# EAGLE design 16bit_Wing_Template (EAGLE 5.06)
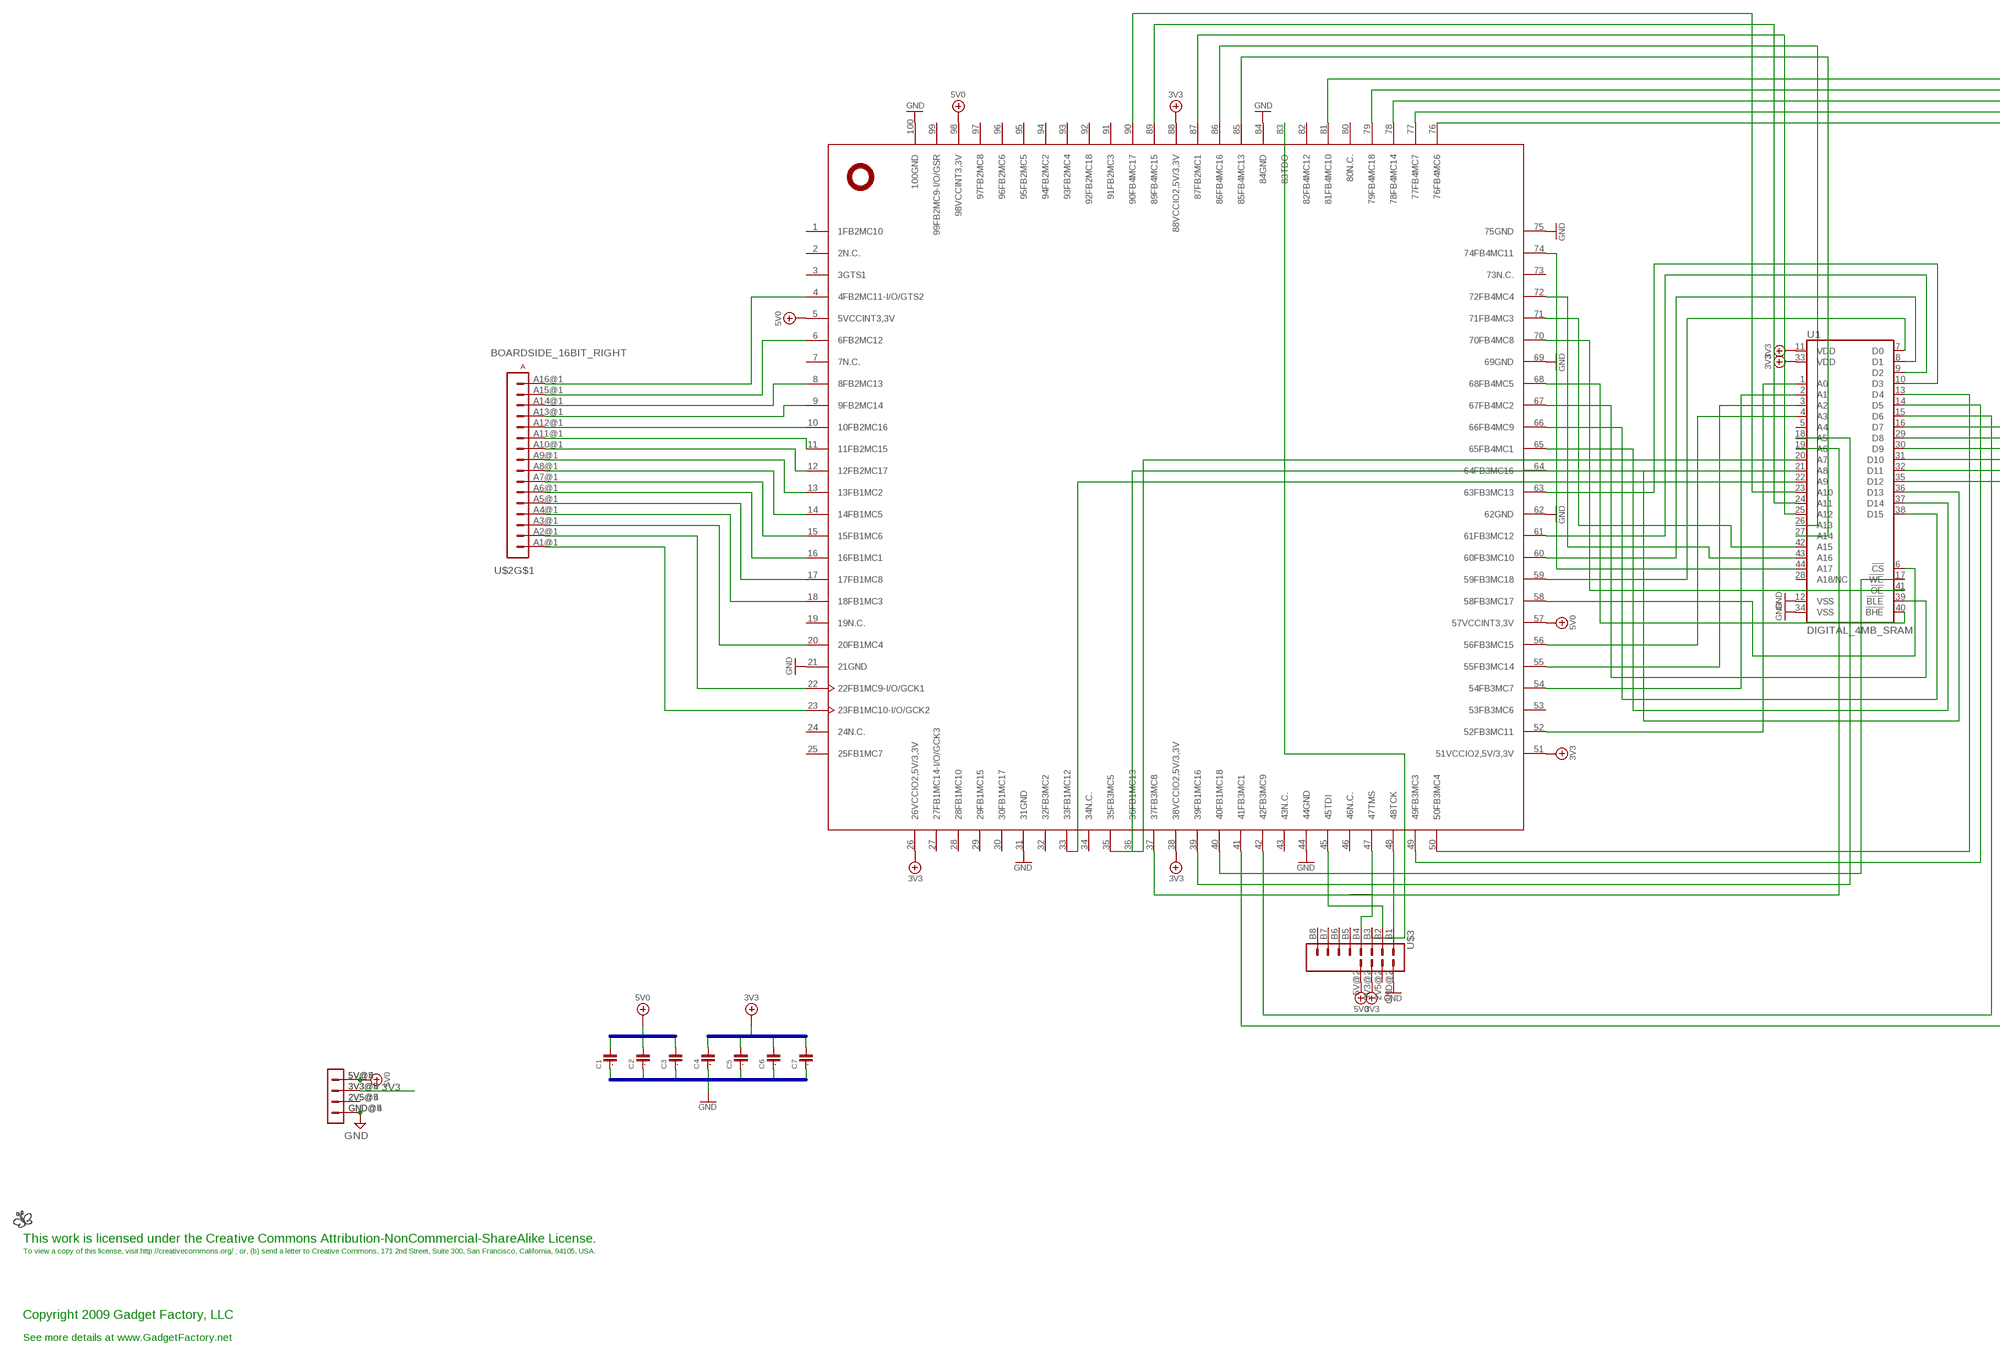
[diagram p0: schematic, sheet 1]

## Parts
C1  C0805  [0805]
C2  C0805  [0805]
C3  C0805  [0805]
C4  C0805  [0805]
C5  C0805  [0805]
C6  C0805  [0805]
C7  C0805  [0805]
LOGO1  BUTTERFLY_LOGO  [BUTTERFLY_LOGO]
U1  DIGITAL_4MB_SRAM  [TSOP44-II]
U$1  XC9572XLTQ100  [TQ100]
U$2  BOARDSIDE_16BIT_RIGHT  [BOARDSIDE_16BIT_RIGHT]
U$3  WING_8BIT  [WINGSIDE_8BIT]

## Nets
3V3: C4.2 C5.2 C6.2 C7.2 U1.11(VDD) U1.33(VDD) U$1.26(26VCCIO2,5V/3,3V) U$1.38(38VCCIO2,5V/3,3V) U$1.51(51VCCIO2,5V/3,3V) U$1.88(88VCCIO2,5V/3,3V) U$2.3V3@4(3V3) U$2.3V3@5(3V3) U$3.3V3@2(3V3)
5V0: C1.2 C2.2 C3.2 U$1.5(5VCCINT3,3V) U$1.57(57VCCINT3,3V) U$1.98(98VCCINT3,3V) U$2.5V@4(5V) U$2.5V@5(5V) U$3.5V@2(5V)
GND: C1.1 C2.1 C3.1 C4.1 C5.1 C6.1 C7.1 U1.12(VSS) U1.34(VSS) U$1.21(21GND) U$1.31(31GND) U$1.44(44GND) U$1.62(62GND) U$1.69(69GND) U$1.75(75GND) U$1.84(84GND) U$1.100(100GND) U$2.GND@4(GND) U$2.GND@5(GND) U$3.GND@2(GND)
N$1: U$1.48(48TCK) U$3.B1
N$2: U$1.4(4FB2MC11-I/O/GTS2) U$2.A16@1(A16)
N$3: U$2.2V5@4(2V5) U$2.2V5@5(2V5)
N$4: U$1.6(6FB2MC12) U$2.A15@1(A15)
N$5: U$1.8(8FB2MC13) U$2.A14@1(A14)
N$6: U$1.9(9FB2MC14) U$2.A13@1(A13)
N$7: U$1.10(10FB2MC16) U$2.A12@1(A12)
N$8: U$1.11(11FB2MC15) U$2.A11@1(A11)
N$9: U$1.12(12FB2MC17) U$2.A10@1(A10)
N$10: U$1.13(13FB1MC2) U$2.A9@1(A9)
N$11: U$1.14(14FB1MC5) U$2.A8@1(A8)
N$12: U$1.15(15FB1MC6) U$2.A7@1(A7)
N$13: U$1.16(16FB1MC1) U$2.A6@1(A6)
N$14: U$1.17(17FB1MC8) U$2.A5@1(A5)
N$15: U$1.18(18FB1MC3) U$2.A4@1(A4)
N$16: U$1.20(20FB1MC4) U$2.A3@1(A3)
N$17: U$1.22(22FB1MC9-I/O/GCK1) U$2.A2@1(A2)
N$18: U$1.23(23FB1MC10-I/O/GCK2) U$2.A1@1(A1)
N$19: U1.1(A0) U$1.52(52FB3MC11)
N$20: U1.2(A1) U$1.54(54FB3MC7)
N$21: U1.3(A2) U$1.55(55FB3MC14)
N$22: U1.4(A3) U$1.56(56FB3MC15)
N$23: U1.6(!CS) U$1.58(58FB3MC17)
N$24: U1.7(D0) U$1.59(59FB3MC18)
N$25: U1.8(D1) U$1.60(60FB3MC10)
N$26: U1.9(D2) U$1.61(61FB3MC12)
N$27: U1.10(D3) U$1.63(63FB3MC13)
N$28: U1.41(!OE) U$1.70(70FB4MC8)
N$29: U1.44(A17) U$1.74(74FB4MC11)
N$30: U1.43(A16) U$1.72(72FB4MC4)
N$31: U1.42(A15) U$1.71(71FB4MC3)
N$32: U1.40(!BHE) U$1.68(68FB4MC5)
N$33: U1.39(!BLE) U$1.67(67FB4MC2)
N$34: U1.38(D15) U$1.66(66FB4MC9)
N$35: U1.37(D14) U$1.65(65FB4MC1)
N$36: U1.36(D13) U$1.64(64FB3MC16)
N$37: U$1.45(45TDI) U$3.B2
N$39: U$1.47(47TMS) U$3.B4
N$40: U$1.83(83TDO) U$3.B3
N$41: U1.13(D4) U$1.50(50FB3MC4)
N$42: U1.14(D5) U$1.49(49FB3MC3)
N$43: U1.15(D6) U$1.42(42FB3MC9)
N$44: U1.16(D7) U$1.41(41FB3MC1)
N$45: U1.17(!WE) U$1.40(40FB1MC18)
N$46: U1.18(A5) U$1.39(39FB1MC16)
N$47: U1.19(A6) U$1.37(37FB3MC8)
N$48: U1.20(A7) U$1.36(36FB1MC13)
N$49: U1.21(A8) U$1.35(35FB3MC5)
N$50: U1.22(A9) U$1.33(33FB1MC12)
N$51: U1.35(D12) U$1.76(76FB4MC6)
N$52: U1.32(D11) U$1.77(77FB4MC7)
N$53: U1.31(D10) U$1.78(78FB4MC14)
N$54: U1.30(D9) U$1.79(79FB4MC18)
N$55: U1.29(D8) U$1.81(81FB4MC10)
N$56: U1.27(A14) U$1.85(85FB4MC13)
N$57: U1.26(A13) U$1.86(86FB4MC16)
N$58: U1.25(A12) U$1.87(87FB2MC1)
N$59: U1.24(A11) U$1.89(89FB4MC15)
N$60: U1.23(A10) U$1.90(90FB4MC17)
Unconnected: U1.5(A4) U1.28(A18/NC) U$1.1(1FB2MC10) U$1.2(2N.C.) U$1.3(3GTS1) U$1.7(7N.C.) U$1.19(19N.C.) U$1.24(24N.C.) U$1.25(25FB1MC7) U$1.27(27FB1MC14-I/O/GCK3) U$1.28(28FB1MC10) U$1.29(29FB1MC15) U$1.30(30FB1MC17) U$1.32(32FB3MC2) U$1.34(34N.C.) U$1.43(43N.C.) U$1.46(46N.C.) U$1.53(53FB3MC6) U$1.73(73N.C.) U$1.80(80N.C.) U$1.82(82FB4MC12) U$1.91(91FB2MC3) U$1.92(92FB2MC18) U$1.93(93FB2MC4) U$1.94(94FB2MC2) U$1.95(95FB2MC5) U$1.96(96FB2MC6) U$1.97(97FB2MC8) U$1.99(99FB2MC9-I/O/GSR) U$3.2V5@2(2V5) U$3.B5 U$3.B6 U$3.B7 U$3.B8

## Buses
GND
5V0
3V3

## Notes on the sheet
- This work is licensed under the Creative Commons Attribution-NonCommercial-ShareAlike License.
- To view a copy of this license, visit http://creativecommons.org/ ; or, (b) send a letter to Creative Commons, 171 2nd Street, Suite 300, San Francisco, California, 94105, USA.
- Copyright 2009 Gadget Factory, LLC
- See more details at www.GadgetFactory.net

## Library data of the parts
C1-C7 = GadgetFactory:C: CAPACITOR, European symbol
LOGO1 = GadgetFactory_Pub:BUTTERFLY_LOGO
U1 = Bogdan_Commons:DIGITAL_4MB_SRAM
U$1 = xilinx_xc9572xl-tq100:XC9572XLTQ100
U$2 = GadgetFactory_Pub:BOARDSIDE_16BIT_RIGHT
U$3 = GadgetFactory_Pub:WING_8BIT

## Board
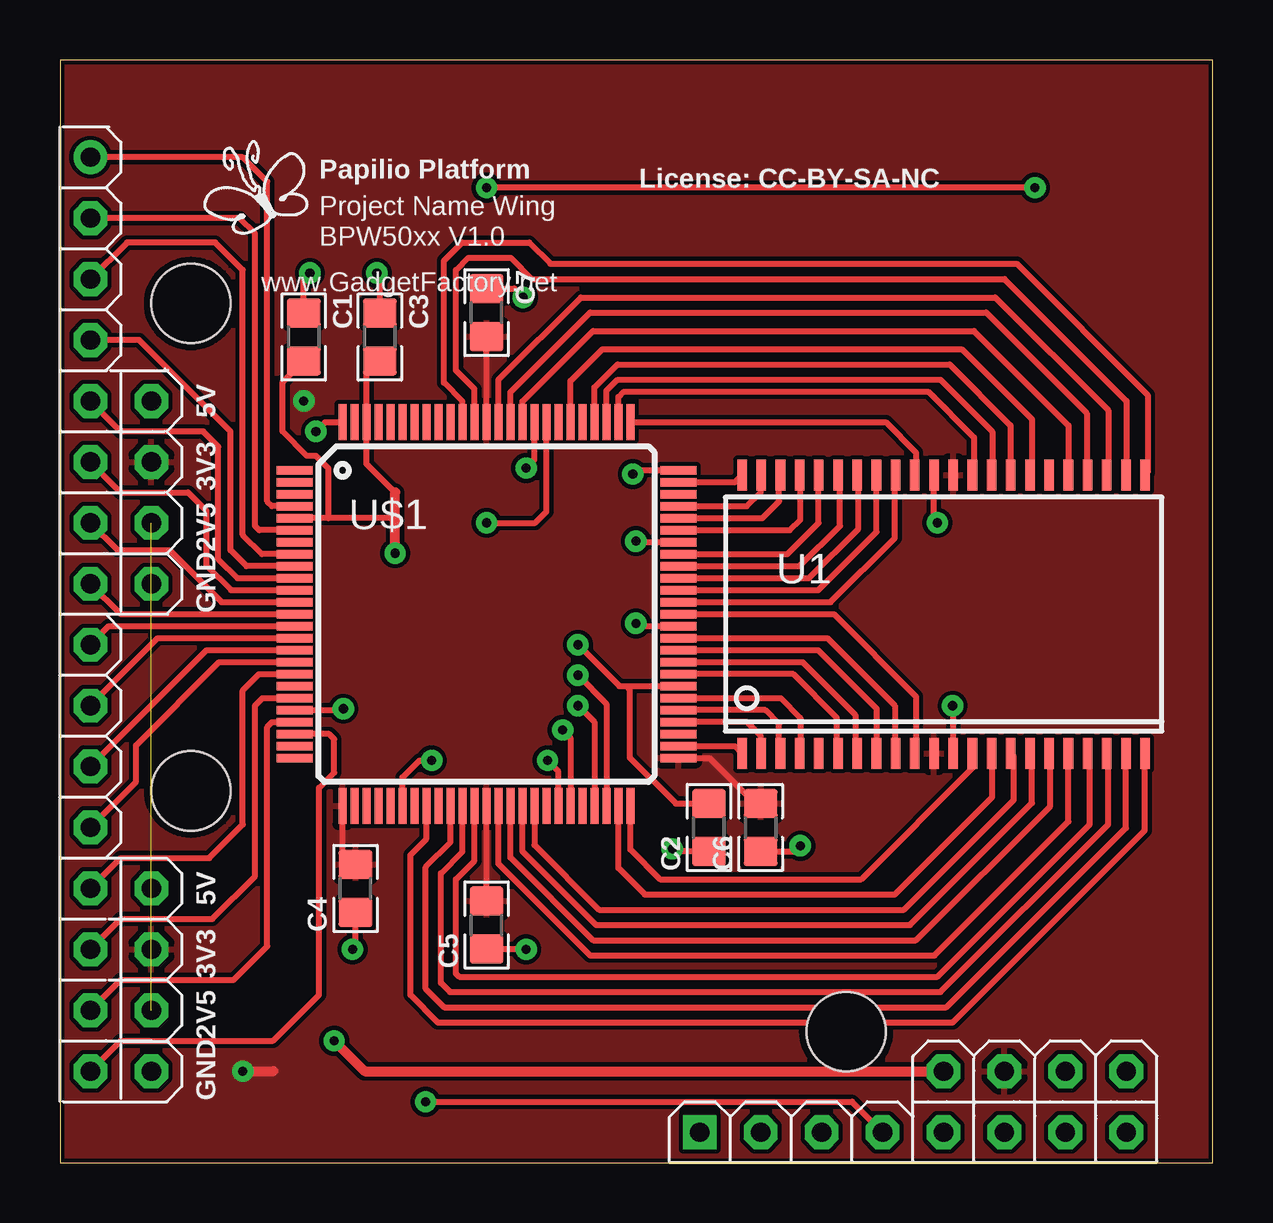
[diagram p1: board, top side]
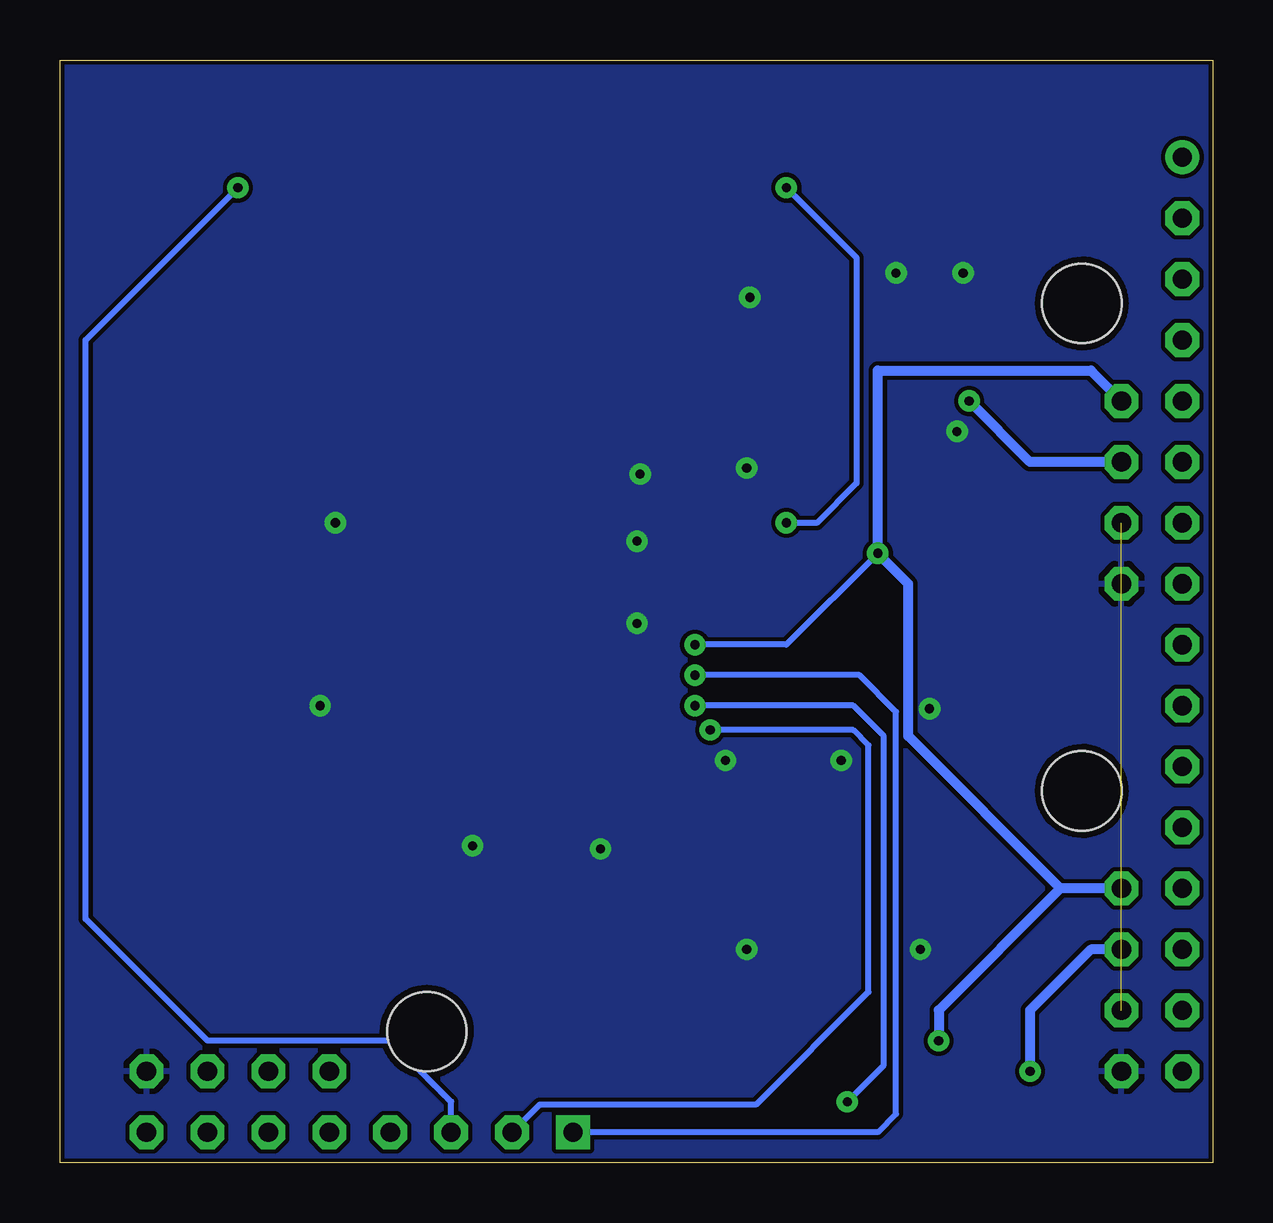
[diagram p2: board, bottom side, seen from below]

Size 48.06 x 45.96 mm. Coordinates in mm from the lower left corner, seen from the top.
Outline: 0,0 48.06,0 48.06,45.96 0,45.96 0,0
Copper layers (1*16): Top 0.035mm / dielectric 1.5mm / Bottom 0.035mm
Design rules "SparkFun_Derived_GoldePheonix_7mil *": minimum track width 7mil, minimum drill 15mil, track to track 7mil, track to pad 7mil, pad to pad 7mil, via to via 7mil, smd to smd 7mil, copper to edge 7mil, drill to drill 7mil, minimum pad ring 12mil, minimum via ring 10mil, stop-mask expansion 4mil, vias tented up to drill 18mil, thermal gap 10mil

### Footprints (pad centres in the part's own frame; a part is rotated, then mirrored left to right if it is on the bottom)
0805 = smd 1.2 x 1.4: 1 -1,0; 2 1,0
TSOP44-II = smd 0.4 x 1.3: 1 -8.4,-5.8; 2 -7.6,-5.8; 3 -6.8,-5.8; 4 -6,-5.8; 5 -5.2,-5.8; 6 -4.4,-5.8; 7 -3.6,-5.8; 8 -2.8,-5.8; 9 -2,-5.8; 10 -1.2,-5.8; 11 -0.4,-5.8; 12 0.4,-5.8; 13 1.2,-5.8; 14 2,-5.8; 15 2.8,-5.8; 16 3.6,-5.8; 17 4.4,-5.8; 18 5.2,-5.8; 19 6,-5.8; 20 6.8,-5.8; 21 7.6,-5.8; 22 8.4,-5.8; 23 8.4,5.8; 24 7.6,5.8; 25 6.8,5.8; 26 6,5.8; 27 5.2,5.8; 28 4.4,5.8; 29 3.6,5.8; 30 2.8,5.8; 31 2,5.8; 32 1.2,5.8; 33 0.4,5.8; 34 -0.4,5.8; 35 -1.2,5.8; 36 -2,5.8; 37 -2.8,5.8; 38 -3.6,5.8; 39 -4.4,5.8; 40 -5.2,5.8; 41 -6,5.8; 42 -6.8,5.8; 43 -7.6,5.8; 44 -8.4,5.8
TQ100 = smd 1.5 x 0.35: 1 -4.19,3.46; 2 -4.19,2.96; 3 -4.19,2.46; 4 -4.19,1.96; 5 -4.19,1.46; 6 -4.19,0.96; 7 -4.19,0.46; 8 -4.19,-0.04; 9 -4.19,-0.54; 10 -4.19,-1.04; 11 -4.19,-1.54; 12 -4.19,-2.04; 13 -4.19,-2.54; 14 -4.19,-3.04; 15 -4.19,-3.54; 16 -4.19,-4.04; 17 -4.19,-4.54; 18 -4.19,-5.04; 19 -4.19,-5.54; 20 -4.19,-6.04; 21 -4.19,-6.54; 22 -4.19,-7.04; 23 -4.19,-7.54; 24 -4.19,-8.04; 25 -4.19,-8.54; 51 11.81,-8.54; 52 11.81,-8.04; 53 11.81,-7.54; 54 11.81,-7.04; 55 11.81,-6.54; 56 11.81,-6.04; 57 11.81,-5.54; 58 11.81,-5.04; 59 11.81,-4.54; 60 11.81,-4.04; 61 11.81,-3.54; 62 11.81,-3.04; 63 11.81,-2.54; 64 11.81,-2.04; 65 11.81,-1.54; 66 11.81,-1.04; 67 11.81,-0.54; 68 11.81,-0.04; 69 11.81,0.46; 70 11.81,0.96; 71 11.81,1.46; 72 11.81,1.96; 73 11.81,2.46; 74 11.81,2.96; 75 11.81,3.46 | smd 0.35 x 1.5: 26 -2.19,-10.54; 27 -1.69,-10.54; 28 -1.19,-10.54; 29 -0.69,-10.54; 30 -0.19,-10.54; 31 0.31,-10.54; 32 0.81,-10.54; 33 1.31,-10.54; 34 1.81,-10.54; 35 2.31,-10.54; 36 2.81,-10.54; 37 3.31,-10.54; 38 3.81,-10.54; 39 4.31,-10.54; 40 4.81,-10.54; 41 5.31,-10.54; 42 5.81,-10.54; 43 6.31,-10.54; 44 6.81,-10.54; 45 7.31,-10.54; 46 7.81,-10.54; 47 8.31,-10.54; 48 8.81,-10.54; 49 9.31,-10.54; 50 9.81,-10.54; 76 9.81,5.46; 77 9.31,5.46; 78 8.81,5.46; 79 8.31,5.46; 80 7.81,5.46; 81 7.31,5.46; 82 6.81,5.46; 83 6.31,5.46; 84 5.81,5.46; 85 5.31,5.46; 86 4.81,5.46; 87 4.31,5.46; 88 3.81,5.46; 89 3.31,5.46; 90 2.81,5.46; 91 2.31,5.46; 92 1.81,5.46; 93 1.31,5.46; 94 0.81,5.46; 95 0.31,5.46; 96 -0.19,5.46; 97 -0.69,5.46; 98 -1.19,5.46; 99 -1.69,5.46; 100 -2.19,5.46
BOARDSIDE_16BIT_RIGHT@1 = drill 0.8 octagon: 2V5@4 3.81,-16.51; 2V5@5 3.81,3.81; 3V3@4 3.81,-13.97; 3V3@5 3.81,6.35; 5V@4 3.81,-11.43; 5V@5 3.81,8.89; A1@1 1.27,-19.05; A2@1 1.27,-16.51; A3@1 1.27,-13.97; A4@1 1.27,-11.43; A5@1 1.27,-8.89; A6@1 1.27,-6.35; A7@1 1.27,-3.81; A8@1 1.27,-1.27; A9@1 1.27,1.27; A10@1 1.27,3.81; A11@1 1.27,6.35; A12@1 1.27,8.89; A13@1 1.27,11.43; A14@1 1.27,13.97; A15@1 1.27,16.51; GND@4 3.81,-19.05; GND@5 3.81,1.27 | drill 0.8 round: A16@1 1.27,19.05 | hole 3.302: 5.461,12.954; 5.461,-7.366
WINGSIDE_8BIT@1 = drill 0.8 octagon: 2V5@2 16.51,3.81; 3V3@2 13.97,3.81; 5V@2 11.43,3.81; B2 3.81,1.27; B3 6.35,1.27; B4 8.89,1.27; B5 11.43,1.27; B6 13.97,1.27; B7 16.51,1.27; B8 19.05,1.27; GND@2 19.05,3.81 | drill 0.8 square: B1 1.27,1.27 | hole 3.302: 7.366,5.461

### Placement (x,y rotation side)
C1  10.16,34.42 270 top
C2  27.05,13.97 90 top
C3  13.34,34.42 270 top
C4  12.32,11.43 90 top
C5  17.78,9.91 90 top
C6  29.21,13.97 90 top
C7  17.78,35.43 270 top
LOGO1  BUTTERFLY_LOGO  [BUTTERFLY_LOGO@1]  8.26,40.13 0 top
U1  36.83,22.86 0 top
U$1  13.97,25.4 0 top
U$2  BOARDSIDE_16BIT_RIGHT  [BOARDSIDE_16BIT_RIGHT@1]  0,22.86 0 top
U$3  WING_8BIT  [WINGSIDE_8BIT@1]  25.4,0 0 top

### Tracks (layer width: path | path; a pad name or v marks a point on that pad's centre or on a via)
3V3  (via drill 0.38)
  Top 0.254: U$1.88 C7.2 | C6.2 29.21,15.24 28.7,15.24 27.08,16.86 U$1.51 | C5.2 U$1.38 | U$1.26 11.78,12.97 C4.2
  Top 0.406: v7.62,3.81 8.89,3.81 | v10.16,31.75 10.41,31.75
  Bottom 0.406: U$2.3V3@4 5.08,8.89 7.62,6.35 v7.62,3.81 | U$2.3V3@5 7.62,29.21 v10.16,31.75
  pour Top: 0.13,45.85 47.88,45.85 47.88,0.13 0.13,0.13
5V0  (via drill 0.38)
  Top 0.254: 13.97,27.94 12.78,29.13 U$1.98 12.78,32.86 C3.2 | 11.2,26.86 13.78,26.86 13.97,26.67 | 11.2,26.86 U$1.5 | 23.62,19.86 23.32,19.86 v21.59,21.59 | 23.62,19.86 U$1.57 | 11.2,26.86 11.2,28.94 10.67,29.46 10.29,29.46 9.27,30.48 9.27,32.53 C1.2 | 23.62,19.86 23.75,19.73 23.75,16.89 25.67,14.97 C2.2
  Top 0.406: v13.97,25.4 13.97,26.67 13.97,27.94 | U$3.5V@2 12.7,3.81 v11.43,5.08
  Bottom 0.254: v21.59,21.59 17.78,21.59 v13.97,25.4
  Bottom 0.406: U$2.5V@4 6.35,11.43 | 6.35,11.43 12.7,17.78 12.7,24.13 v13.97,25.4 13.97,33.02 5.08,33.02 U$2.5V@5 | v11.43,5.08 11.43,6.35 6.35,11.43
GND  (via drill 0.38)
  Top 0.254: U1.34 36.43,26.82 v36.58,26.67 | U1.12 37.23,19.03 v37.21,19.05 | U$1.75 24.03,28.86 v23.88,28.7 | U$1.69 24.05,25.86 v24,25.91 | U$1.62 24.12,22.36 v24,22.48 | U$1.84 19.78,29.3 v19.43,28.96 | U$1.21 11.75,18.86 v11.81,18.92 | U$1.31 14.28,16.06 14.99,16.76 v15.49,16.76 | U$1.44 20.78,16.3 v20.32,16.76 | U$1.100 11.05,30.86 v10.67,30.48 | C1.1 10.16,36.83 v10.41,37.08 | C3.1 13.34,36.96 v13.21,37.08 | C4.1 12.32,9.02 v12.19,8.89 | C5.1 19.41,8.91 v19.43,8.89 | C2.1 25.64,12.97 v25.53,13.08 | C6.1 30.62,12.97 v30.86,13.21 | C7.1 18.94,36.43 v19.3,36.07
  Bottom 0.254: v36.58,26.67 36.7,26.67 | v37.21,19.05 37.34,19.18 | v23.88,28.7 23.88,28.57 | v24,25.91 24,26.04 | v24,22.48 24,22.61 | v19.43,28.96 19.3,28.96 | v11.81,18.92 11.81,19.05 | v15.49,16.76 15.62,16.76 | v20.32,16.76 20.19,16.76 | 10.67,30.35 v10.67,30.48 | v10.41,37.08 10.67,37.08 | v13.21,37.08 13.08,37.08 | v12.19,8.89 12.06,8.89 | v19.43,8.89 19.43,8.76 | v25.53,13.08 25.65,13.21 | v30.86,13.21 30.86,13.34 | v19.3,36.07 19.3,35.81
  pour Bottom: 0.13,45.85 47.88,45.85 47.88,0.13 0.13,0.13
N$1  (via drill 0.38)
  Top 0.254: U$1.48 22.78,19.13 v21.59,20.32
  Bottom 0.254: v21.59,20.32 14.73,20.32 13.21,18.8 13.21,2.03 13.97,1.27 U$3.B1
N$2
  Top 0.254: U$1.4 8.84,27.36 8.64,27.56 8.64,40.89 7.62,41.91 U$2.A16@1
N$3  (1 unrouted)
N$4
  Top 0.254: U$1.6 8.31,26.36 8.13,26.54 8.13,38.73 7.49,39.37 U$2.A15@1
N$5
  Top 0.254: U$1.8 8.42,25.36 7.62,26.16 7.62,37.21 6.48,38.35 2.79,38.35 U$2.A14@1
N$6
  Top 0.254: U$1.9 7.78,24.86 7.11,25.53 7.11,30.48 3.3,34.29 U$2.A13@1
N$7
  Top 0.254: U$1.10 7.39,24.36 6.6,25.15 6.6,29.84 5.97,30.48 2.54,30.48 U$2.A12@1
N$8
  Top 0.254: U$1.11 7.13,23.86 6.1,24.89 6.1,27.18 5.33,27.94 2.54,27.94 U$2.A11@1
N$9
  Top 0.254: U$1.12 6.74,23.36 4.57,25.53 2.41,25.53 U$2.A10@1
N$10
  Top 0.254: U$1.13 2.54,22.86 U$2.A9@1
N$11
  Top 0.254: U$1.14 2.04,22.36 U$2.A8@1
N$12
  Top 0.254: U$1.15 4.08,21.86 U$2.A7@1
N$13
  Top 0.254: U$1.16 6.12,21.36 U$2.A6@1
N$14
  Top 0.254: U$1.17 6.64,20.86 3.17,17.4 3.17,15.88 U$2.A5@1
N$15
  Top 0.254: U$1.18 8.29,20.36 7.62,19.68 7.62,14.1 6.22,12.7 2.54,12.7 U$2.A4@1
N$16
  Top 0.254: U$1.20 8.44,19.36 8.13,19.05 8.13,11.94 6.35,10.16 2.54,10.16 U$2.A3@1
N$17
  Top 0.254: U$1.22 8.84,18.36 8.64,18.16 8.64,9.02 7.24,7.62 2.54,7.62 U$2.A2@1
N$18
  Top 0.254: U$1.23 11.22,17.86 11.43,17.65 11.43,16.26 10.79,15.62 10.79,6.99 8.89,5.08 2.54,5.08 U$2.A1@1
N$19
  Top 0.254: U$1.52 28.13,17.36 U1.1
N$20
  Top 0.254: U$1.54 28.63,18.36 29.21,17.78 29.21,17.08 U1.2
N$21
  Top 0.254: U$1.55 29.4,18.86 29.97,18.29 29.97,17.12 U1.3
N$22
  Top 0.254: U$1.56 30.04,19.36 30.86,18.54 30.86,17.09 U1.4
N$23
  Top 0.254: U$1.58 30.57,20.36 32.38,18.54 32.38,17.11 U1.6
N$24
  Top 0.254: U$1.59 30.96,20.86 33.15,18.67 33.15,17.14 U1.7
N$25
  Top 0.254: U$1.60 31.6,21.36 34.04,18.92 U1.8
N$26
  Top 0.254: U$1.61 31.99,21.86 34.8,19.05 34.8,17.09 U1.9
N$27
  Top 0.254: U$1.63 32.26,22.86 35.69,19.43 35.69,17.12 U1.10
N$28
  Top 0.254: U$1.70 30.42,26.36 30.86,26.8 30.86,28.63 U1.41
N$29
  Top 0.254: U$1.74 28.13,28.36 U1.44
N$30
  Top 0.254: U$1.72 28.63,27.36 29.21,27.94 29.21,28.64 U1.43
N$31
  Top 0.254: U$1.71 29.27,26.86 29.97,27.56 29.97,28.6 U1.42
N$32
  Top 0.254: U$1.68 30.31,25.36 31.62,26.67 U1.40
N$33
  Top 0.254: U$1.67 30.83,24.86 32.51,26.54 32.51,28.58 U1.39
N$34
  Top 0.254: U$1.66 31.22,24.36 33.27,26.42 33.27,28.62 U1.38
N$35
  Top 0.254: U$1.65 31.61,23.86 34.04,26.29 U1.37
N$36
  Top 0.254: U$1.64 32.12,23.36 34.8,26.04 34.8,28.63 U1.36
N$37  (via drill 0.38)
  Top 0.254: U$1.45 21.28,17.71 v20.95,18.03
  Bottom 0.254: v20.95,18.03 14.99,18.03 14.35,17.4 14.35,7.11 19.05,2.41 28.07,2.41 U$3.B2
N$39  (via drill 0.38)
  Top 0.254: U$1.47 22.28,18.36 v21.59,19.05 | v15.24,2.54 33.02,2.54 U$3.B4
  Bottom 0.254: v21.59,19.05 14.99,19.05 13.72,17.78 13.72,4.06 v15.24,2.54
N$40  (via drill 0.38)
  Top 0.254: v40.64,40.64 v17.78,40.64 | U$1.83 20.28,27.14 19.81,26.67 v17.78,26.67
  Bottom 0.254: U$3.B3 31.75,2.54 34.29,5.08 41.91,5.08 46.99,10.16 46.99,34.29 v40.64,40.64 | v17.78,40.64 14.86,37.72 14.86,28.32 16.51,26.67 v17.78,26.67
N$41
  Top 0.254: U1.13 38.1,16.99 38.1,16.51 33.4,11.81 25.02,11.81 23.78,13.05 U$1.50
N$42
  Top 0.254: U1.14 38.86,17.03 38.86,15.24 34.8,11.18 24.38,11.18 23.28,12.28 U$1.49
N$43
  Top 0.254: U1.15 39.75,16.94 39.75,15.11 35.18,10.54 22.48,10.54 19.78,13.24 U$1.42
N$44
  Top 0.254: U1.16 40.51,16.98 40.51,14.99 35.43,9.91 22.35,9.91 19.28,12.98 U$1.41
N$45
  Top 0.254: U1.17 41.27,17.02 41.27,14.86 35.69,9.27 22.23,9.27 18.78,12.72 U$1.40
N$46
  Top 0.254: U1.18 42.04,14.22 36.45,8.64 22.1,8.64 18.28,12.45 U$1.39
N$47
  Top 0.254: U1.19 42.93,16.96 42.93,14.1 36.58,7.75 16.64,7.75 16.51,7.87 16.51,11.81 17.28,12.58 U$1.37
N$48
  Top 0.254: U1.20 43.69,17 43.69,14.1 36.7,7.11 16.26,7.11 15.88,7.49 15.88,12.06 16.78,12.97 U$1.36
N$49
  Top 0.254: U1.21 44.43,13.95 36.96,6.48 16,6.48 15.24,7.24 15.24,12.32 16.28,13.36 U$1.35
N$50
  Top 0.254: U1.22 45.21,17.04 45.21,13.84 37.21,5.84 15.75,5.84 14.61,6.99 14.61,12.83 15.28,13.5 U$1.33
N$51
  Top 0.254: U$1.76 34.42,30.86 35.69,29.59 35.69,28.72 U1.35
N$52
  Top 0.254: U$1.77 23.28,31.92 23.5,32.13 36.2,32.13 38.1,30.23 38.1,28.73 U1.32
N$53
  Top 0.254: U$1.78 22.78,32.18 23.24,32.64 36.7,32.64 38.86,30.48 38.86,28.69 U1.31
N$54
  Top 0.254: U$1.79 22.28,32.31 23.24,33.27 37.08,33.27 39.62,30.73 U1.30
N$55
  Top 0.254: U$1.81 21.28,32.58 22.61,33.91 37.59,33.91 40.51,30.99 40.51,28.74 U1.29
N$56
  Top 0.254: U$1.85 19.28,31.73 22.23,34.67 38.1,34.67 42.04,30.73 U1.27
N$57
  Top 0.254: U$1.86 18.78,32.12 22.1,35.43 38.61,35.43 42.8,31.24 42.8,28.69 U1.26
N$58
  Top 0.254: U$1.87 18.28,32.63 21.72,36.07 38.99,36.07 43.69,31.37 43.69,28.72 U1.25
N$59
  Top 0.254: U1.24 44.45,28.68 44.45,31.75 39.37,36.83 19.68,36.83 18.8,37.72 17.02,37.72 16.51,37.21 16.51,33.02 17.28,32.25 U$1.89
N$60
  Top 0.254: U1.23 45.34,28.77 45.34,32 39.88,37.47 20.45,37.47 19.56,38.35 16.76,38.35 16,37.59 16,32.51 16.78,31.73 U$1.90

### Text on the board
Top: Todo: term resistors? | Todo: Add GND on each end of Wing.
tPlace: Papilio Platform | License: CC-BY-SA-NC | Project Name Wing | BPW50xx V1.0 | www.GadgetFactory.net